# EAGLE design TrackerBaseExp2 (EAGLE 9.6.2)
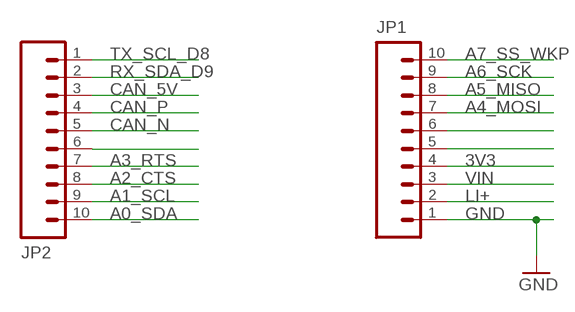
[diagram p0: schematic, sheet 1]

## Parts
JP1  M10  [1X10]
JP2  M10  [1X10]

## Nets
3V3: JP1.4
A0_SDA: JP2.10
A1_SCL: JP2.9
A2_CTS: JP2.8
A3_RTS: JP2.7
A4_MOSI: JP1.7
A5_MISO: JP1.8
A6_SCK: JP1.9
A7_SS_WKP: JP1.10
CAN_5V: JP2.3
CAN_N: JP2.5
CAN_P: JP2.4
GND: JP1.1
LI+: JP1.2
N$21: JP1.6
N$22: JP1.5
N$23: JP2.6
RX_SDA_D9: JP2.2
TX_SCL_D8: JP2.1
VIN: JP1.3

## Library data of the parts
JP1 JP2 = rickk2:M10: Sullins Connector Solutions PPTC101LFBN-RC $0.65 10 Position Header Connector Through Hole https://www.digikey.com/product-detail/en/sullins-connector-solutions/PPTC101LFBN-RC/S7008-ND/810149

## Board
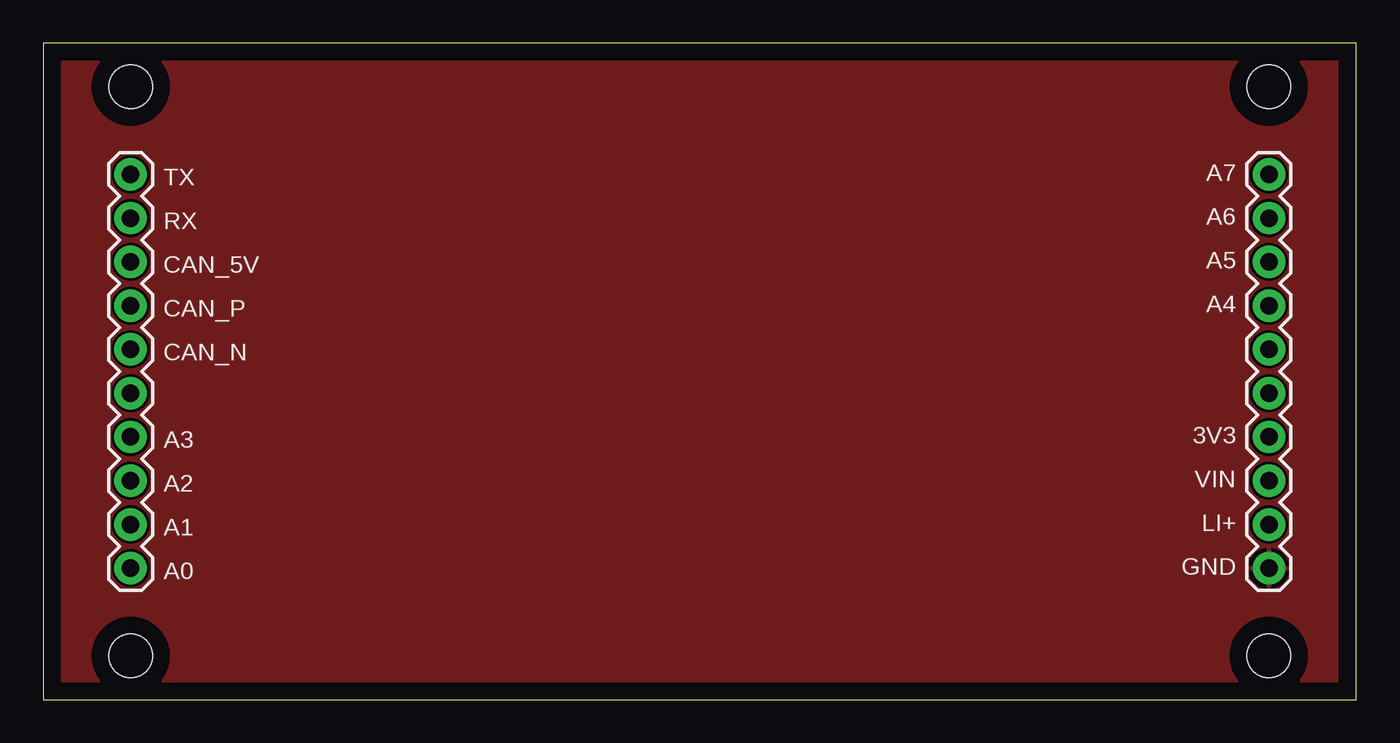
[diagram p1: board, top side]
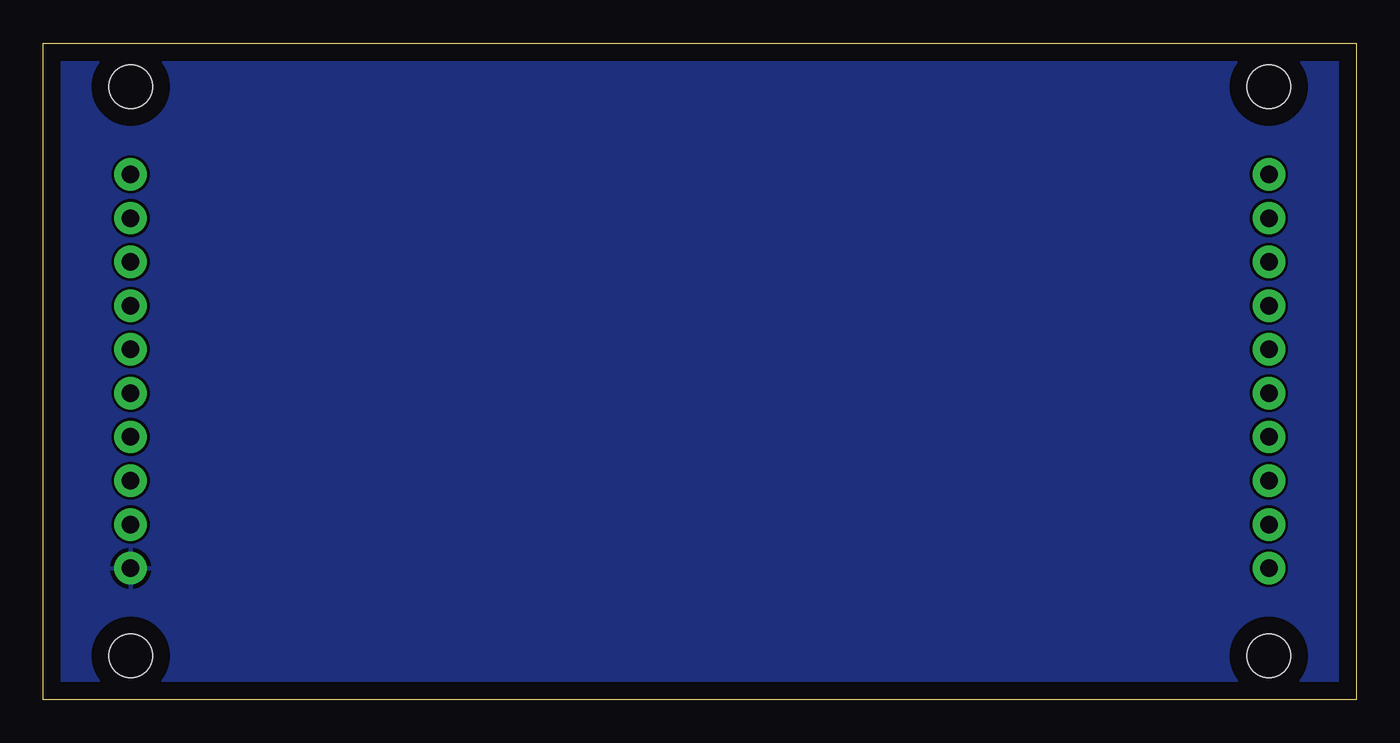
[diagram p2: board, bottom side, seen from below]

Size 76.2 x 38.1 mm. Coordinates in mm from the lower left corner, seen from the top.
Outline: 0,0 76.2,0 76.2,38.1 0,38.1 0,0
Copper layers (1*16): Top 0.035mm / dielectric 1.5mm / Bottom 0.035mm
Design rules "default": minimum track width 6mil, minimum drill 0.35mm, track to track 6mil, track to pad 6mil, pad to pad 6mil, via to via 6mil, smd to smd 6mil, copper to edge 40mil, drill to drill 6mil, minimum pad ring 10mil, minimum via ring 8mil, stop-mask expansion 4mil, vias tented up to drill 0mil, thermal gap 10mil
Holes 2.5 mm at 5.08,2.54 71.12,2.54 71.12,35.56 5.08,35.56

### Footprints (pad centres in the part's own frame; a part is rotated, then mirrored left to right if it is on the bottom)
1X10 = drill 1.016 pad 1.88: 1 0,0; 2 2.54,0; 3 5.08,0; 4 7.62,0; 5 10.16,0; 6 12.7,0; 7 15.24,0; 8 17.78,0; 9 20.32,0; 10 22.86,0

### Placement (x,y rotation side)
JP1  71.12,7.62 90 top
JP2  5.08,30.48 270 top

### Tracks (layer width: path | path; a pad name or v marks a point on that pad's centre or on a via)
GND
  pour Top: 0,0 0,40.64 78.74,40.64 78.74,0 78.11,0
  pour Bottom: 0,0 0,41.91 80.01,41.91 80.01,0

### Text on the board
tPlace: A7 | TX | A6 | RX | A5 | CAN_5V | A4 | CAN_P | CAN_N | 3V3 | A3 | VIN | A2 | LI+ | A1 | GND | A0